# Altium schematic sheet FPGA_board_controller_sheet.SchDoc
size A; SheetNumber: 1; SheetTotal: 4
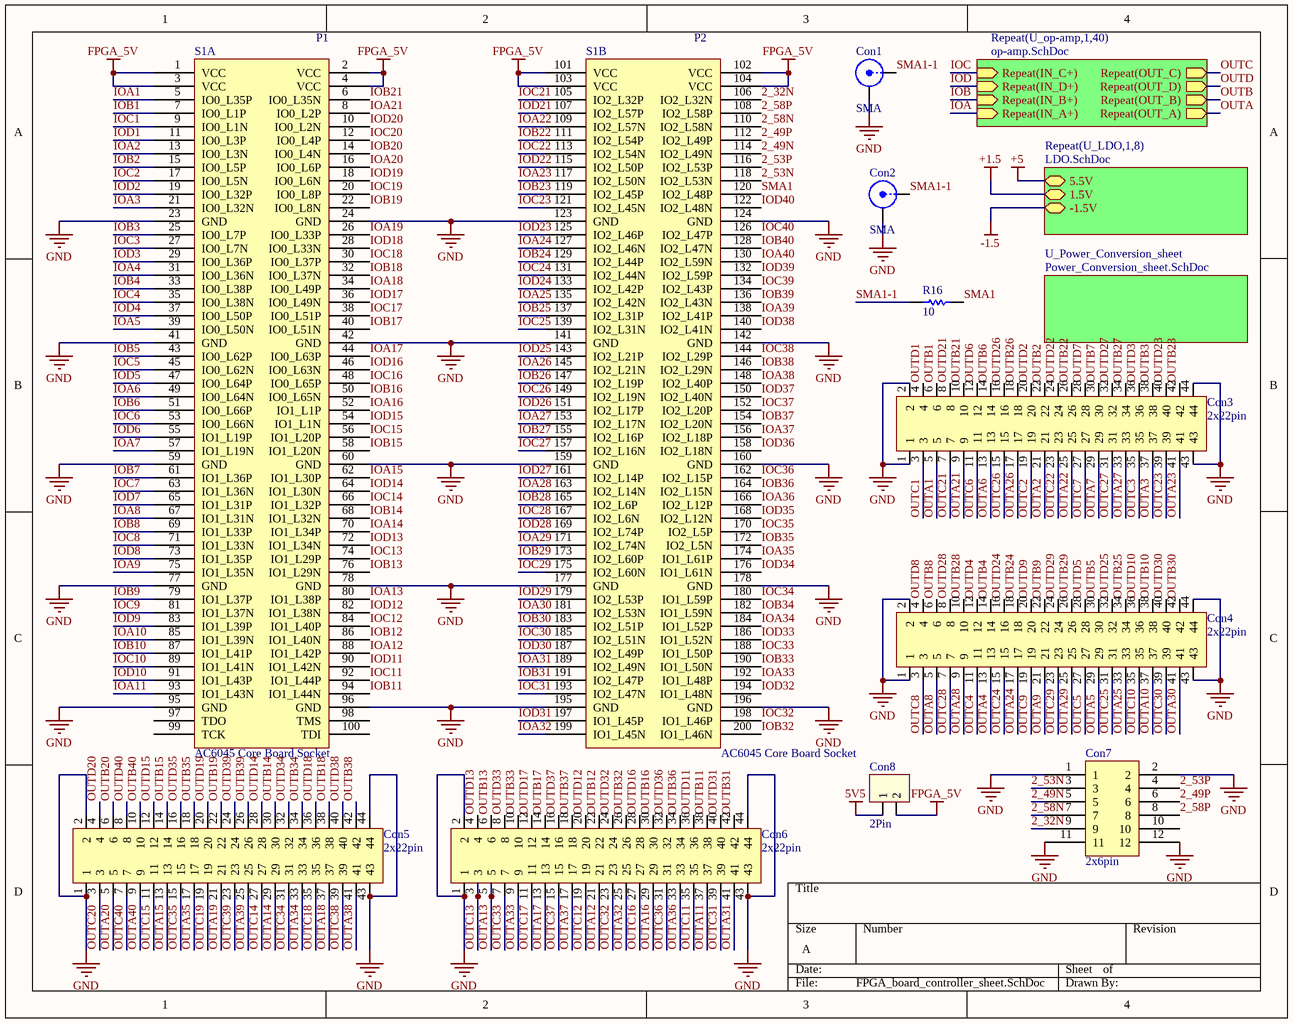
[diagram p0: FPGA_board_controller_sheet.SchDoc]

## Parts
Con1  SMA  [SMA (3.5mm)]
Con2  SMA  [SMA (3.5mm)]
Con3  2x22pin  [2mm_2x22pin]
Con4  2x22pin  [2mm_2x22pin]
Con5  2x22pin  [2mm_2x22pin]
Con6  2x22pin  [2mm_2x22pin]
Con7  2x6pin  [2MM_2*6PIN]
Con8  2Pin  [XH2.54-2pin]
R16  10  [R0603]
S1  AC6045 Core Board Socket  [Core Board Socket]  (parts A,B of 2)

## Sub-sheets
Repeat(U_LDO,1,8) = LDO.SchDoc: 5.5V (bidir), 1.5V (bidir), -1.5V (bidir)
Repeat(U_op-amp,1,40) = op-amp.SchDoc: Repeat(IN_C+) (in), Repeat(OUT_C) (out), Repeat(OUT_D) (out), Repeat(IN_D+) (in), Repeat(OUT_B) (out), Repeat(IN_B+) (in), Repeat(OUT_A) (out), Repeat(IN_A+) (in)
U_Power_Conversion_sheet = Power_Conversion_sheet.SchDoc: no entries

## Nets
5V5: Con8.1
+1.5: sheet Repeat(U_LDO,1,8)/1.5V
+5: sheet Repeat(U_LDO,1,8)/5.5V
-1.5: sheet Repeat(U_LDO,1,8)/-1.5V
FPGA_5V: Con8.2 S1.1(VCC) S1.2(VCC) S1.3(VCC) S1.4(VCC) S1.101(VCC) S1.102(VCC) S1.103(VCC) S1.104(VCC)
GND: Con1.2(Y) Con2.2(Y) Con3.1 Con3.2 Con3.43 Con3.44 Con4.1 Con4.2 Con4.43 Con4.44 Con5.1 Con5.2 Con5.43 Con5.44 Con6.1 Con6.2 Con6.43 Con6.44 Con7.1 Con7.2 Con7.11 Con7.12 S1.23(GND) S1.24(GND) S1.41(GND) S1.42(GND) S1.59(GND) S1.60(GND) S1.77(GND) S1.78(GND) S1.95(GND) S1.96(GND) S1.123(GND) S1.124(GND) S1.141(GND) S1.142(GND) S1.159(GND) S1.160(GND) S1.177(GND) S1.178(GND) S1.195(GND) S1.196(GND)
2_32N: Con7.9 S1.106(IO2_L32N)
2_49N: Con7.5 S1.114(IO2_L49N)
2_49P: Con7.6 S1.112(IO2_L49P)
2_53N: Con7.3 S1.118(IO2_L53N)
2_53P: Con7.4 S1.116(IO2_L53P)
2_58N: Con7.7 S1.110(IO2_L58N)
2_58P: Con7.8 S1.108(IO2_L58P)
IOA: sheet Repeat(U_op-amp,1,40)/Repeat(IN_A+)
IOA1: S1.5(IO0_L35P)
IOA2: S1.13(IO0_L3N)
IOA3: S1.21(IO0_L32N)
IOA4: S1.31(IO0_L36N)
IOA5: S1.39(IO0_L50N)
IOA6: S1.49(IO0_L64N)
IOA7: S1.57(IO1_L19N)
IOA8: S1.67(IO1_L31N)
IOA9: S1.75(IO1_L35N)
IOA10: S1.85(IO1_L39N)
IOA11: S1.93(IO1_L43N)
IOA12: S1.88(IO1_L42P)
IOA13: S1.80(IO1_L38P)
IOA14: S1.70(IO1_L34P)
IOA15: S1.62(IO1_L30P)
IOA16: S1.52(IO1_L1P)
IOA17: S1.44(IO0_L63P)
IOA18: S1.34(IO0_L49P)
IOA19: S1.26(IO0_L33P)
IOA20: S1.16(IO0_L6P)
IOA21: S1.8(IO0_L2P)
IOA22: S1.109(IO2_L57N)
IOA23: S1.117(IO2_L50N)
IOA24: S1.127(IO2_L46N)
IOA25: S1.135(IO2_L42N)
IOA26: S1.145(IO2_L21N)
IOA27: S1.153(IO2_L17N)
IOA28: S1.163(IO2_L14N)
IOA29: S1.171(IO2_L74N)
IOA30: S1.181(IO2_L53N)
IOA31: S1.189(IO2_L49N)
IOA32: S1.199(IO1_L45N)
IOA33: S1.192(IO1_L48P)
IOA34: S1.184(IO1_L52P)
IOA35: S1.174(IO1_L61P)
IOA36: S1.166(IO2_L12P)
IOA37: S1.156(IO2_L18P)
IOA38: S1.148(IO2_L40P)
IOA39: S1.138(IO2_L41P)
IOA40: S1.130(IO2_L59N)
IOB: sheet Repeat(U_op-amp,1,40)/Repeat(IN_B+)
IOB1: S1.7(IO0_L1P)
IOB2: S1.15(IO0_L5P)
IOB3: S1.25(IO0_L7P)
IOB4: S1.33(IO0_L38P)
IOB5: S1.43(IO0_L62P)
IOB6: S1.51(IO0_L66P)
IOB7: S1.61(IO1_L36P)
IOB8: S1.69(IO1_L33P)
IOB9: S1.79(IO1_L37P)
IOB10: S1.87(IO1_L41P)
IOB11: S1.94(IO1_L44N)
IOB12: S1.86(IO1_L40N)
IOB13: S1.76(IO1_L29N)
IOB14: S1.68(IO1_L32N)
IOB15: S1.58(IO1_L20N)
IOB16: S1.50(IO0_L65N)
IOB17: S1.40(IO0_L51N)
IOB18: S1.32(IO0_L37N)
IOB19: S1.22(IO0_L8N)
IOB20: S1.14(IO0_L4N)
IOB21: S1.6(IO0_L35N)
IOB22: S1.111(IO2_L54P)
IOB23: S1.119(IO2_L45P)
IOB24: S1.129(IO2_L44P)
IOB25: S1.137(IO2_L31P)
IOB26: S1.147(IO2_L19P)
IOB27: S1.155(IO2_L16P)
IOB28: S1.165(IO2_L6P)
IOB29: S1.173(IO2_L60P)
IOB30: S1.183(IO2_L51P)
IOB31: S1.191(IO2_L47P)
IOB32: S1.200(IO1_L46N)
IOB33: S1.190(IO1_L50N)
IOB34: S1.182(IO1_L59N)
IOB35: S1.172(IO2_L5N)
IOB36: S1.164(IO2_L15N)
IOB37: S1.154(IO2_L20N)
IOB38: S1.146(IO2_L29N)
IOB39: S1.136(IO2_L43N)
IOB40: S1.128(IO2_L47N)
IOC: sheet Repeat(U_op-amp,1,40)/Repeat(IN_C+)
IOC1: S1.9(IO0_L1N)
IOC2: S1.17(IO0_L5N)
IOC3: S1.27(IO0_L7N)
IOC4: S1.35(IO0_L38N)
IOC5: S1.45(IO0_L62N)
IOC6: S1.53(IO0_L66N)
IOC7: S1.63(IO1_L36N)
IOC8: S1.71(IO1_L33N)
IOC9: S1.81(IO1_L37N)
IOC10: S1.89(IO1_L41N)
IOC11: S1.92(IO1_L44P)
IOC12: S1.84(IO1_L40P)
IOC13: S1.74(IO1_L29P)
IOC14: S1.66(IO1_L32P)
IOC15: S1.56(IO1_L20P)
IOC16: S1.48(IO0_L65P)
IOC17: S1.38(IO0_L51P)
IOC18: S1.30(IO0_L37P)
IOC19: S1.20(IO0_L8P)
IOC20: S1.12(IO0_L4P)
IOC21: S1.105(IO2_L32P)
IOC22: S1.113(IO2_L54N)
IOC23: S1.121(IO2_L45N)
IOC24: S1.131(IO2_L44N)
IOC25: S1.139(IO2_L31N)
IOC26: S1.149(IO2_L19N)
IOC27: S1.157(IO2_L16N)
IOC28: S1.167(IO2_L6N)
IOC29: S1.175(IO2_L60N)
IOC30: S1.185(IO2_L51N)
IOC31: S1.193(IO2_L47N)
IOC32: S1.198(IO1_L46P)
IOC33: S1.188(IO1_L50P)
IOC34: S1.180(IO1_L59P)
IOC35: S1.170(IO2_L5P)
IOC36: S1.162(IO2_L15P)
IOC37: S1.152(IO2_L20P)
IOC38: S1.144(IO2_L29P)
IOC39: S1.134(IO2_L43P)
IOC40: S1.126(IO2_L47P)
IOD: sheet Repeat(U_op-amp,1,40)/Repeat(IN_D+)
IOD1: S1.11(IO0_L3P)
IOD2: S1.19(IO0_L32P)
IOD3: S1.29(IO0_L36P)
IOD4: S1.37(IO0_L50P)
IOD5: S1.47(IO0_L64P)
IOD6: S1.55(IO1_L19P)
IOD7: S1.65(IO1_L31P)
IOD8: S1.73(IO1_L35P)
IOD9: S1.83(IO1_L39P)
IOD10: S1.91(IO1_L43P)
IOD11: S1.90(IO1_L42N)
IOD12: S1.82(IO1_L38N)
IOD13: S1.72(IO1_L34N)
IOD14: S1.64(IO1_L30N)
IOD15: S1.54(IO1_L1N)
IOD16: S1.46(IO0_L63N)
IOD17: S1.36(IO0_L49N)
IOD18: S1.28(IO0_L33N)
IOD19: S1.18(IO0_L6N)
IOD20: S1.10(IO0_L2N)
IOD21: S1.107(IO2_L57P)
IOD22: S1.115(IO2_L50P)
IOD23: S1.125(IO2_L46P)
IOD24: S1.133(IO2_L42P)
IOD25: S1.143(IO2_L21P)
IOD26: S1.151(IO2_L17P)
IOD27: S1.161(IO2_L14P)
IOD28: S1.169(IO2_L74P)
IOD29: S1.179(IO2_L53P)
IOD30: S1.187(IO2_L49P)
IOD31: S1.197(IO1_L45P)
IOD32: S1.194(IO1_L48N)
IOD33: S1.186(IO1_L52N)
IOD34: S1.176(IO1_L61N)
IOD35: S1.168(IO2_L12N)
IOD36: S1.158(IO2_L18N)
IOD37: S1.150(IO2_L40N)
IOD38: S1.140(IO2_L41N)
IOD39: S1.132(IO2_L59P)
IOD40: S1.122(IO2_L48N)
OUTA: sheet Repeat(U_op-amp,1,40)/Repeat(OUT_A)
OUTA1: Con3.5
OUTA2: Con3.21
OUTA3: Con3.37
OUTA4: Con4.13
OUTA5: Con4.29
OUTA6: Con3.13
OUTA7: Con3.29
OUTA8: Con4.5
OUTA9: Con4.21
OUTA10: Con4.37
OUTA11: Con6.37
OUTA12: Con6.21
OUTA13: Con6.5
OUTA14: Con5.29
OUTA15: Con5.13
OUTA16: Con6.29
OUTA17: Con6.13
OUTA18: Con5.37
OUTA19: Con5.21
OUTA20: Con5.5
OUTA21: Con3.9
OUTA22: Con3.25
OUTA23: Con3.41
OUTA24: Con4.17
OUTA25: Con4.33
OUTA26: Con3.17
OUTA27: Con3.33
OUTA28: Con4.9
OUTA29: Con4.25
OUTA30: Con4.41
OUTA31: Con6.41
OUTA32: Con6.25
OUTA33: Con6.9
OUTA34: Con5.33
OUTA35: Con5.17
OUTA36: Con6.33
OUTA37: Con6.17
OUTA38: Con5.41
OUTA39: Con5.25
OUTA40: Con5.9
OUTB: sheet Repeat(U_op-amp,1,40)/Repeat(OUT_B)
OUTB1: Con3.6
OUTB2: Con3.22
OUTB3: Con3.38
OUTB4: Con4.14
OUTB5: Con4.30
OUTB6: Con3.14
OUTB7: Con3.30
OUTB8: Con4.6
OUTB9: Con4.22
OUTB10: Con4.38
OUTB11: Con6.38
OUTB12: Con6.22
OUTB13: Con6.6
OUTB14: Con5.30
OUTB15: Con5.14
OUTB16: Con6.30
OUTB17: Con6.14
OUTB18: Con5.38
OUTB19: Con5.22
OUTB20: Con5.6
OUTB21: Con3.10
OUTB22: Con3.26
OUTB23: Con3.42
OUTB24: Con4.18
OUTB25: Con4.34
OUTB26: Con3.18
OUTB27: Con3.34
OUTB28: Con4.10
OUTB29: Con4.26
OUTB30: Con4.42
OUTB31: Con6.42
OUTB32: Con6.26
OUTB33: Con6.10
OUTB34: Con5.34
OUTB35: Con5.18
OUTB36: Con6.34
OUTB37: Con6.18
OUTB38: Con5.42
OUTB39: Con5.26
OUTB40: Con5.10
OUTC: sheet Repeat(U_op-amp,1,40)/Repeat(OUT_C)
OUTC1: Con3.3
OUTC2: Con3.19
OUTC3: Con3.35
OUTC4: Con4.11
OUTC5: Con4.27
OUTC6: Con3.11
OUTC7: Con3.27
OUTC8: Con4.3
OUTC9: Con4.19
OUTC10: Con4.35
OUTC11: Con6.35
OUTC12: Con6.19
OUTC13: Con6.3
OUTC14: Con5.27
OUTC15: Con5.11
OUTC16: Con6.27
OUTC17: Con6.11
OUTC18: Con5.35
OUTC19: Con5.19
OUTC20: Con5.3
OUTC21: Con3.7
OUTC22: Con3.23
OUTC23: Con3.39
OUTC24: Con4.15
OUTC25: Con4.31
OUTC26: Con3.15
OUTC27: Con3.31
OUTC28: Con4.7
OUTC29: Con4.23
OUTC30: Con4.39
OUTC31: Con6.39
OUTC32: Con6.23
OUTC33: Con6.7
OUTC34: Con5.31
OUTC35: Con5.15
OUTC36: Con6.31
OUTC37: Con6.15
OUTC38: Con5.39
OUTC39: Con5.23
OUTC40: Con5.7
OUTD: sheet Repeat(U_op-amp,1,40)/Repeat(OUT_D)
OUTD1: Con3.4
OUTD2: Con3.20
OUTD3: Con3.36
OUTD4: Con4.12
OUTD5: Con4.28
OUTD6: Con3.12
OUTD7: Con3.28
OUTD8: Con4.4
OUTD9: Con4.20
OUTD10: Con4.36
OUTD11: Con6.36
OUTD12: Con6.20
OUTD13: Con6.4
OUTD14: Con5.28
OUTD15: Con5.12
OUTD16: Con6.28
OUTD17: Con6.12
OUTD18: Con5.36
OUTD19: Con5.20
OUTD20: Con5.4
OUTD21: Con3.8
OUTD22: Con3.24
OUTD23: Con3.40
OUTD24: Con4.16
OUTD25: Con4.32
OUTD26: Con3.16
OUTD27: Con3.32
OUTD28: Con4.8
OUTD29: Con4.24
OUTD30: Con4.40
OUTD31: Con6.40
OUTD32: Con6.24
OUTD33: Con6.8
OUTD34: Con5.32
OUTD35: Con5.16
OUTD36: Con6.32
OUTD37: Con6.16
OUTD38: Con5.40
OUTD39: Con5.24
OUTD40: Con5.8
SMA1: R16.2 S1.120(IO2_L48P)
SMA1-1: Con1.1(X) Con2.1(X) R16.1

Not connected (* = marked no-connect by the designer): Con7 10; S1 97(TDO) 98(TMS) 99(TCK) 100(TDI)

## Notes on the sheet
- (in symbol AC6045 Core Board Socket, part A) P1
- (in symbol AC6045 Core Board Socket, part B) P2

## Library data of the parts
R16 = Resistor: value: *